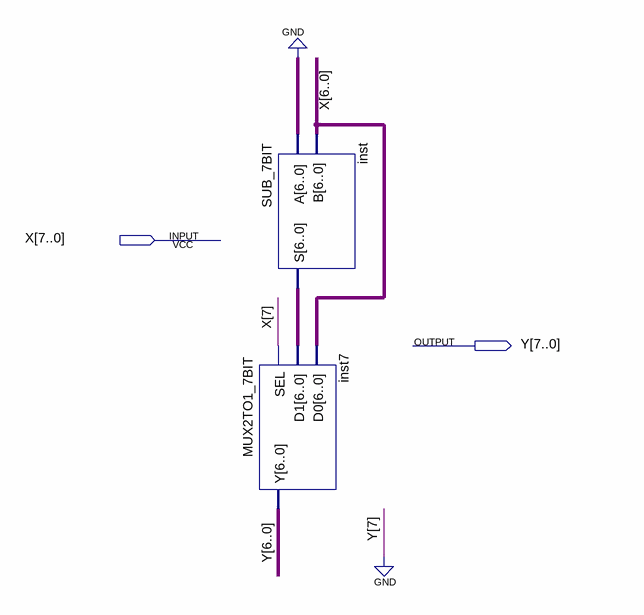
[diagram p0: schematic sheet]
// Quartus schematic Abs.bdf as structural Verilog: 2 symbols, 2 pins
module Abs (
  input  [7:0] X,
  output [7:0] Y
);

  wire [6:0] inst_s;

  SUB_7BIT inst (.A({7{1'b0}}), .B(X[6:0]), .S(inst_s));
  MUX2TO1_7BIT inst7 (.SEL(X[7]), .D1(inst_s), .D0(X[6:0]), .Y(Y[6:0]));

  assign Y[7] = 1'b0;
endmodule
